# EAGLE schematic rx (EAGLE 7.1.0)
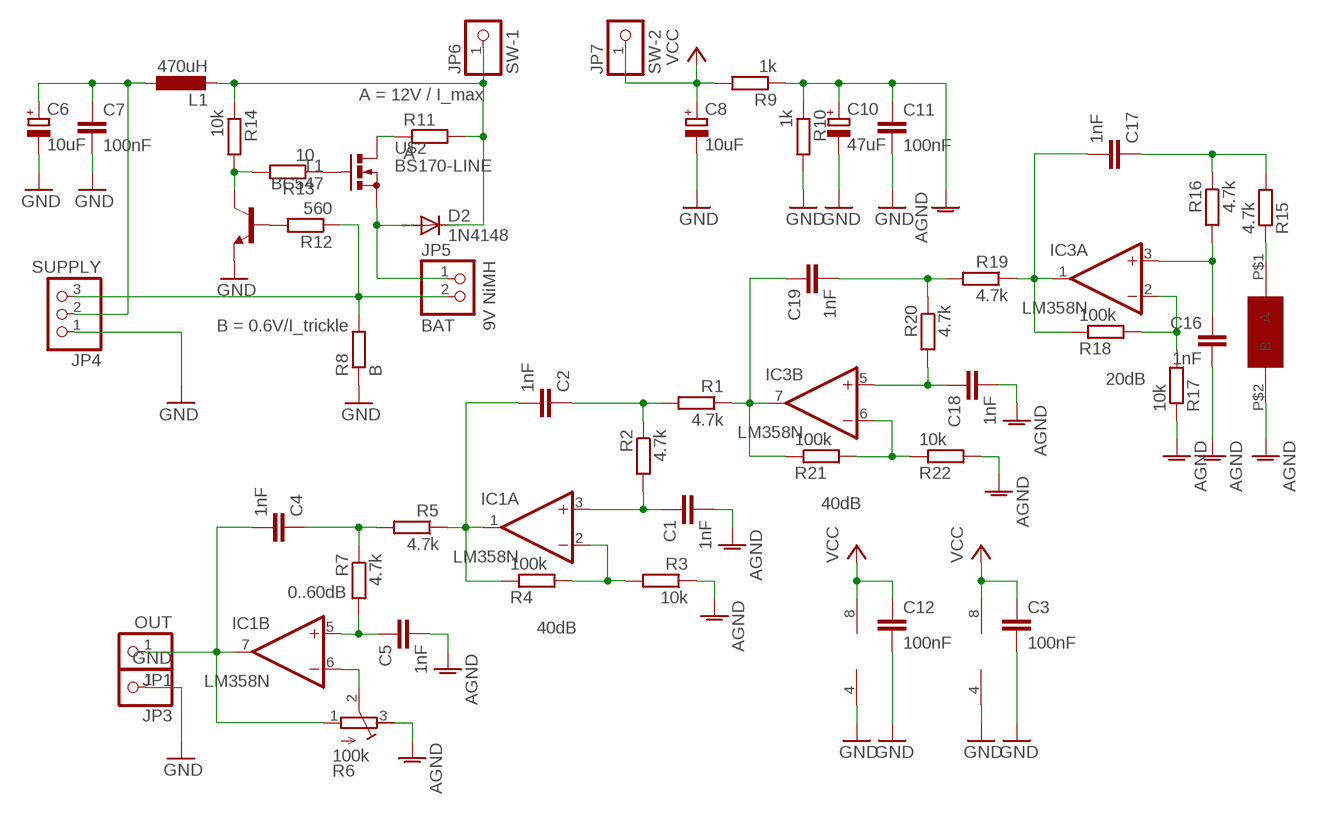
[diagram p0: schematic, sheet 1]

## Parts
C1  1nF  C-EU075-032X103  [C075-032X103]
C2  1nF  C-EU025-025X050  [C025-025X050]
C3  100nF  C-EU025-025X050  [C025-025X050]
C4  1nF  C-EU025-025X050  [C025-025X050]
C5  1nF  C-EU025-025X050  [C025-025X050]
C6  10uF  CPOL-EUE2.5-6  [E2,5-6]
C7  100nF  C-EU025-025X050  [C025-025X050]
C8  10uF  CPOL-EUE2.5-6  [E2,5-6]
C10  47uF  CPOL-EUE2.5-6  [E2,5-6]
C11  100nF  C-EU025-025X050  [C025-025X050]
C12  100nF  C-EU025-025X050  [C025-025X050]
C16  1nF  C-EU025-025X050  [C025-025X050]
C17  1nF  C-EU025-025X050  [C025-025X050]
C18  1nF  C-EU075-032X103  [C075-032X103]
C19  1nF  C-EU025-025X050  [C025-025X050]
D2  1N4148  DIODE-D-2.5  [D-2.5]
IC1  LM358N  [DIL08]
IC3  LM358N  [DIL08]
JP1  OUT  PINHD-1X1  [1X01]
JP3  GND  PINHD-1X1  [1X01]
JP4  SUPPLY  PINHD-1X3  [1X03]
JP5  BAT  PINHD-1X2  [1X02]
JP6  SW-1  PINHD-1X1  [1X01]
JP7  SW-2  PINHD-1X1  [1X01]
L1  470uH  L-EU0204/5  [0204/5]
R1  4.7k  R-EU_0207/10  [0207/10]
R2  4.7k  R-EU_0207/10  [0207/10]
R3  10k  R-EU_0207/10  [0207/10]
R4  100k  R-EU_0204/2V  [0204V]
R5  4.7k  R-EU_0204/7  [0204/7]
R6  100k  R-TRIMM64W  [RTRIM64W]
R7  4.7k  R-EU_0204/7  [0204/7]
R8  B  R-EU_0204/5  [0204/5]
R9  1k  R-EU_0204/5  [0204/5]
R10  1k  R-EU_0204/2V  [0204V]
R11  A  R-EU_0204/5  [0204/5]
R12  560  R-EU_0204/7  [0204/7]
R13  10  R-EU_0204/2V  [0204V]
R14  10k  R-EU_0204/2V  [0204V]
R15  4.7k  R-EU_0204/5  [0204/5]
R16  4.7k  R-EU_0204/5  [0204/5]
R17  10k  R-EU_0204/5  [0204/5]
R18  100k  R-EU_0204/2V  [0204V]
R19  4.7k  R-EU_0207/10  [0207/10]
R20  4.7k  R-EU_0204/7  [0204/7]
R21  100k  R-EU_0204/2V  [0204V]
R22  10k  R-EU_0204/5  [0204/5]
T1  BC547  -NPN-TO92-CBE  [TO92-CBE]
U$1  FERITTE  [FERRITE]
U$2  BS170-LINE  [TO92-LINE]

## Nets
AGND: C1.2 C5.2 C10.+ C11.1 C16.2 C18.2 R3.1 R6.3(E) R9.1 R10.1 R17.1 R22.2 U$1.P$2(B)
GND: C3.2 C6.- C7.2 C8.- C10.- C11.2 C12.2 IC1.4(P:V-) IC3.4(P:V-) JP3.1 JP4.1 R8.1 R10.2 T1.E
N$1: C1.1 IC1.3(A:+IN) R2.2
N$2: C2.1 R1.2 R2.1
N$3: C2.2 IC1.1(A:OUT) R4.1 R5.1
N$4: IC1.2(A:-IN) R3.2 R4.2
N$5: IC1.6(B:-IN) R6.2(S)
N$6: C5.1 IC1.5(B:+IN) R7.2
N$7: R15.1 U$1.P$1(A)
N$8: C4.2 IC1.7(B:OUT) JP1.1 R6.1(A)
N$9: C16.1 IC3.3(A:+IN) R16.2
N$10: C4.1 R5.2 R7.1
N$11: C6.+ C7.1 JP4.2 L1.1
N$12: JP4.3 JP5.2 R8.2 R12.1
N$13: R12.2 T1.B
N$14: D2.A JP5.1 U$2.1(S)
N$15: R11.1 U$2.3(D)
N$16: R13.1 U$2.2(G)
N$17: R13.2 R14.2 T1.C
N$18: D2.C JP6.1 L1.2 R11.2 R14.1
N$20: C17.1 R15.2 R16.1
N$24: C17.2 IC3.1(A:OUT) R18.1 R19.1
N$25: IC3.2(A:-IN) R17.2 R18.2
N$26: IC3.6(B:-IN) R21.2 R22.1
N$27: C18.1 IC3.5(B:+IN) R20.2
N$28: C19.2 R19.2 R20.1
N$29: C19.1 IC3.7(B:OUT) R1.1 R21.1
VCC: C3.1 C8.+ C12.1 IC1.8(P:V+) IC3.8(P:V+) JP7.1 R9.2

## Notes on the sheet
- A = 12V / I_max
- 9V NiMH
- B = 0.6V/I_trickle
- 20dB
- 40dB
- 0..60dB
- 40dB

## Library data of the parts
C1-C5 C7 C11 C12 C16-C19 = rcl:C-EU: CAPACITOR, European symbol
C6 C8 C10 = rcl:CPOL-EU: POLARIZED CAPACITOR, European symbol
D2 = diode:DIODE-: DIODE
IC1 IC3 = linear:LM358: OP AMP also LM158; LM258; LM2904 Source: http://cache.national.com/ds/LM/LM158.pdf
JP1 JP3 JP6 JP7 = pinhead:PINHD-1X1: PIN HEADER
JP4 = pinhead:PINHD-1X3: PIN HEADER
JP5 = pinhead:PINHD-1X2: PIN HEADER
L1 = rcl:L-EU: INDUCTOR, European symbol
R1-R5 R7-R22 = rcl:R-EU_: RESISTOR, European symbol
R6 = rcl:R-TRIMM: Trimm resistor
T1 = transistor-neu-to92:*-NPN-: NPN Transistror
U$1 = feritte:FERITTE
U$2 = transistor-small-signal:BS170-LINE